# Altium project C210 Rev_B_220601.PrjPcb (part 1 of 5)
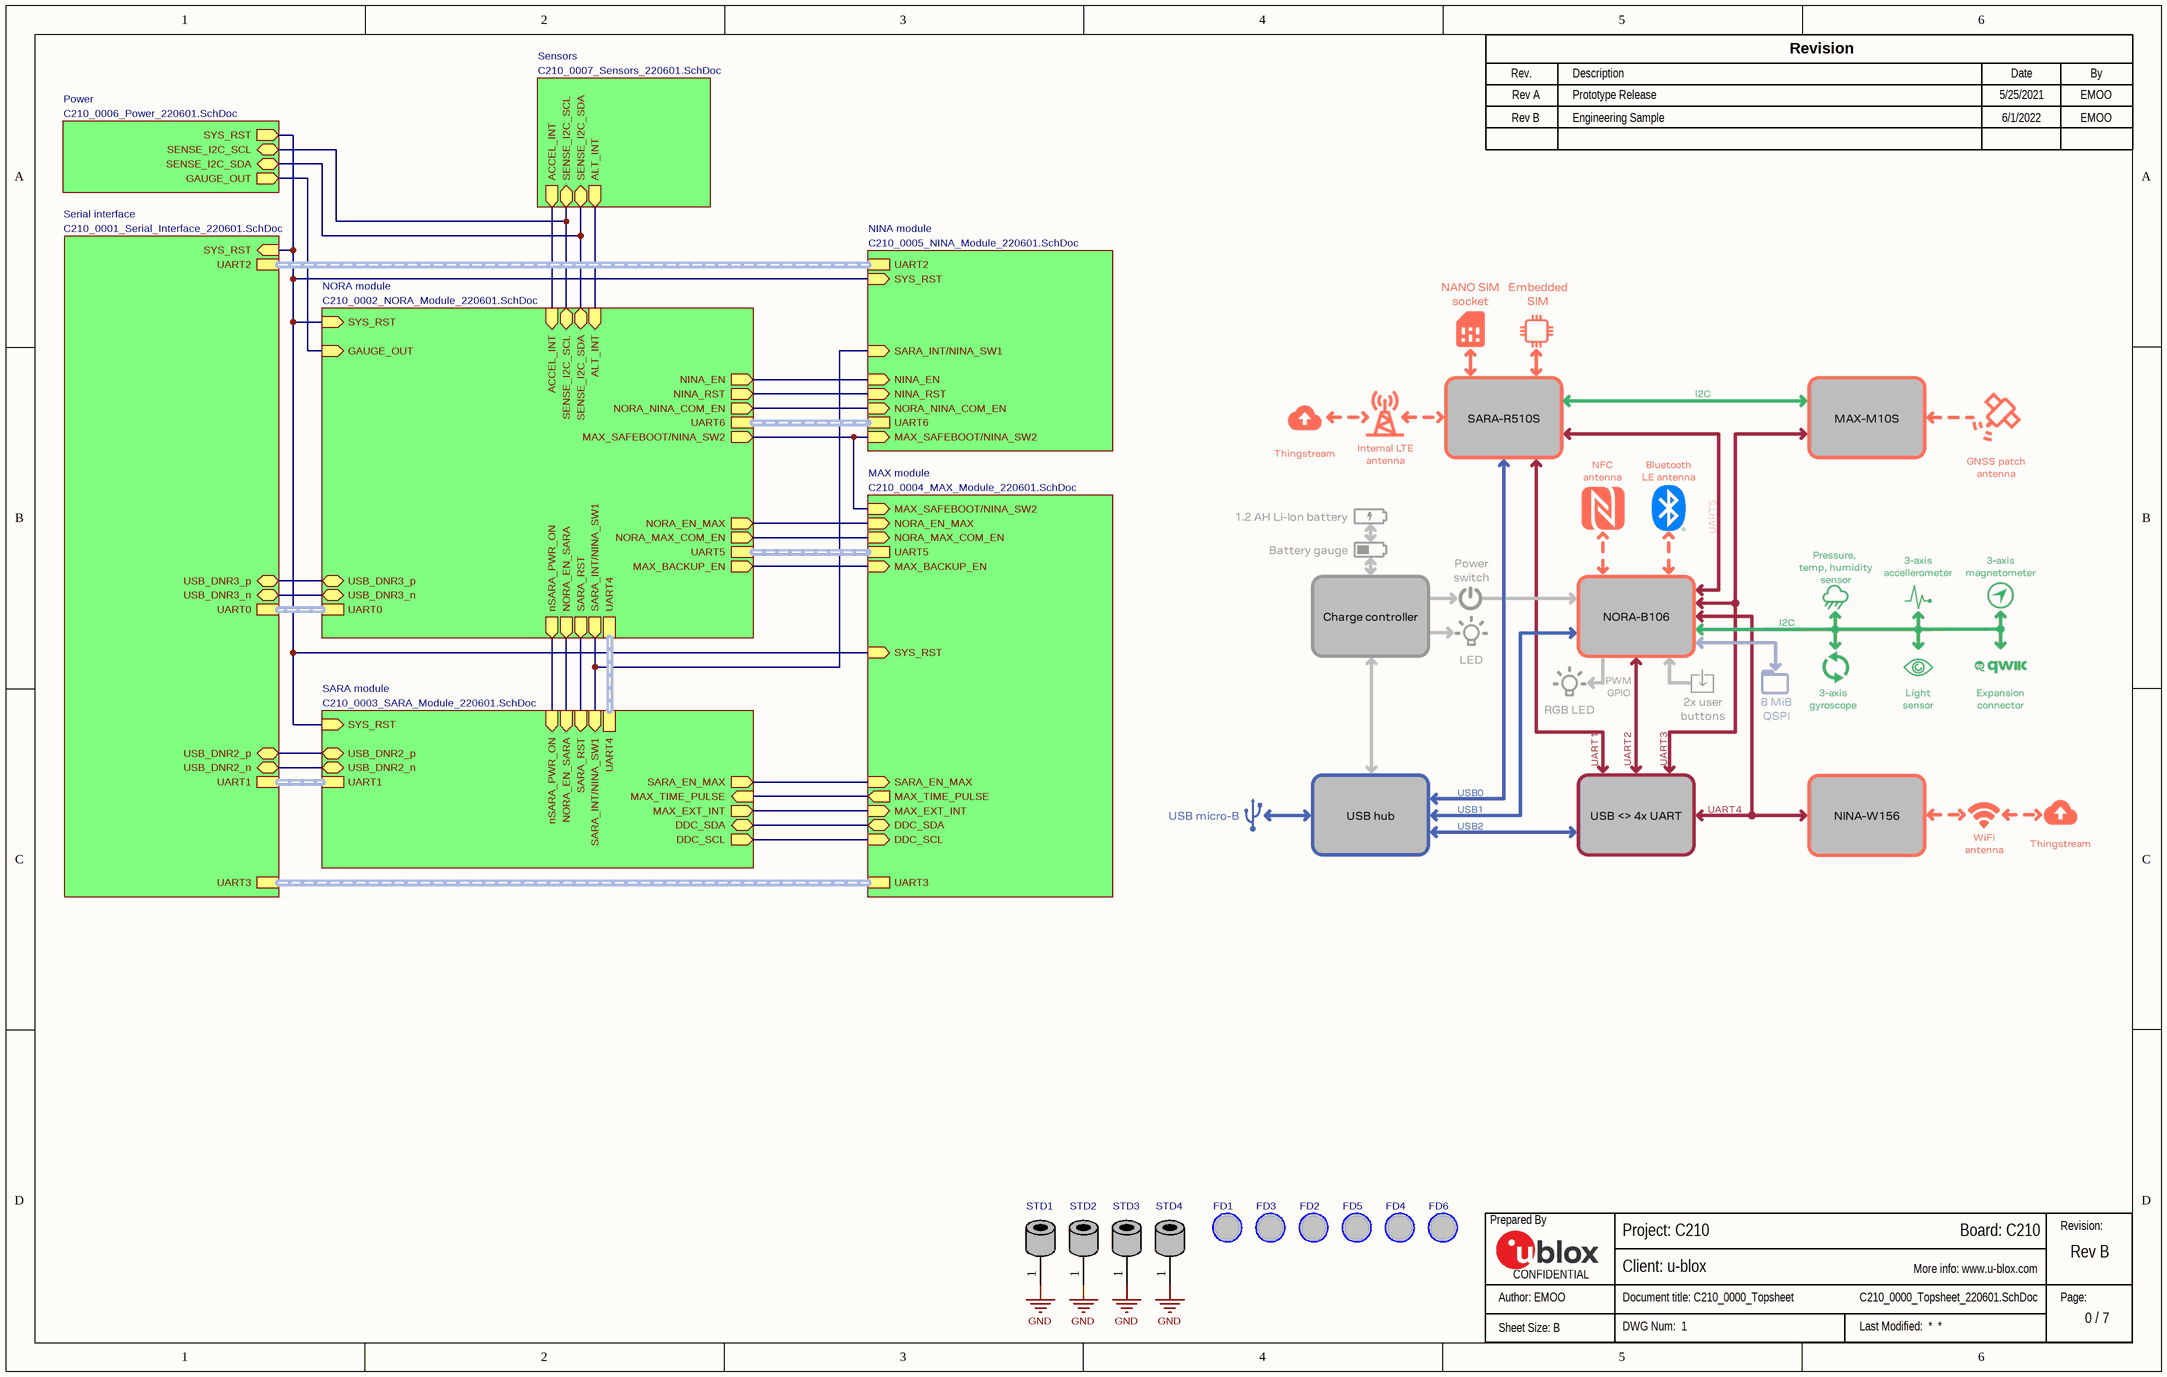
[diagram p0: C210_0000_Topsheet_220601.SchDoc]
SchSheetTotal: 7; SchDocNum: 1; ReleaseRev2: Rev B; ReleaseRev1: Rev A; ReleaseDesc2: Engineering Sample; ReleaseDesc1: Prototype Release; ReleaseDate2: 6/1/2022; ReleaseDate1: 5/25/2021; ReleaseBy2: EMOO; ReleaseBy1: EMOO; ProjectEngineer: EMOO; PCBName: C210; PCBDocNum: C210; GlobalReleaseDate: 6/1/2022; GlobalProjectTeam: u-blox AG; GlobalProjectRevision: Rev B; GlobalProjectName: C210; GlobalProjectLink: www.u-blox.com; GlobalClientName: u-blox
8 sheets, 502 parts. Net scope: flat (ports and power ports of the same name join across sheets).
Board file: C210_220601.PcbDoc
Sheets:
  C210_0000_Topsheet_220601.SchDoc
    NORA module = C210_0002_NORA_Module_220601.SchDoc
    SARA module = C210_0003_SARA_Module_220601.SchDoc
    Power = C210_0006_Power_220601.SchDoc
    Sensors = C210_0007_Sensors_220601.SchDoc
    Serial interface = C210_0001_Serial_Interface_220601.SchDoc
    MAX module = C210_0004_MAX_Module_220601.SchDoc
    NINA module = C210_0005_NINA_Module_220601.SchDoc

## Sheet C210_0000_Topsheet_220601.SchDoc: C210_0000_Topsheet
size B; Date: 2/26/2021; CompanyName: U-blox; DrawnBy: EMOO; Engineer: EMOO; Organization: U-blox; Address1: 2601 25th St. SE; Address2: Salem, OR 97302; SheetNumber: 0; SheetTotal: 7; Website: www.u-blox.com; SheetSize: B; SheetTitle: C-210 Topsheet

### Parts
(Parts that share a designator on the sheet are numbered #1, #2 ... from top to bottom, then left to right.)
?#1  (no value)  (graphical)
?#2  (no value)  (graphical)
FD1  Fiducial_1mmDNP  [Fiducial 1mm - Circle]  (value not drawn)  (no BOM)
FD2  Fiducial_1mmDNP  [Fiducial 1mm - Circle]  (value not drawn)  (no BOM)
FD3  Fiducial_1mmDNP  [Fiducial 1mm - Circle]  (value not drawn)  (no BOM)
FD4  Fiducial_1mmDNP  [Fiducial 1mm - Circle]  (value not drawn)  (no BOM)
FD5  Fiducial_1mmDNP  [Fiducial 1mm - Circle]  (value not drawn)  (no BOM)
FD6  Fiducial_1mmDNP  [Fiducial 1mm - Circle]  (value not drawn)  (no BOM)
STD1  (no value)  [9774020951R]
STD2  (no value)  [9774020951R]
STD3  (no value)  [9774020951R]
STD4  (no value)  [9774020951R]

### Sub-sheets
MAX module = C210_0004_MAX_Module_220601.SchDoc: DDC_SCL (in), DDC_SDA (bidir), UART3 (harness UART3), UART5 (harness UART5), MAX_BACKUP_EN (in), MAX_TIME_PULSE (out), NORA_EN_MAX (in), SARA_EN_MAX (in), NORA_MAX_COM_EN (in), MAX_EXT_INT (in), SYS_RST (in), MAX_SAFEBOOT/NINA_SW2 (in)
NINA module = C210_0005_NINA_Module_220601.SchDoc: UART6 (harness UART6), NORA_NINA_COM_EN (in), NINA_RST (in), UART2 (harness UART2), SYS_RST (in), NINA_EN (in), SARA_INT/NINA_SW1 (in), MAX_SAFEBOOT/NINA_SW2 (in)
NORA module = C210_0002_NORA_Module_220601.SchDoc: UART0 (harness UART0), UART4 (harness UART4), SARA_RST (out), UART5 (harness UART5), ACCEL_INT (in), SENSE_I2C_SDA (bidir), SENSE_I2C_SCL (bidir), NORA_MAX_COM_EN (out), NORA_EN_MAX (out), UART6 (harness UART6), NINA_EN (out), NORA_NINA_COM_EN (out), nSARA_PWR_ON (out), MAX_BACKUP_EN (out), NINA_RST (out), USB_DNR3_p (bidir), USB_DNR3_n (bidir), SYS_RST (in), NORA_EN_SARA (out), GAUGE_OUT (in), ALT_INT (in), SARA_INT/NINA_SW1 (out), MAX_SAFEBOOT/NINA_SW2 (out)
Power = C210_0006_Power_220601.SchDoc: SYS_RST (out), GAUGE_OUT (out), SENSE_I2C_SCL (bidir), SENSE_I2C_SDA (bidir)
SARA module = C210_0003_SARA_Module_220601.SchDoc: UART4 (harness UART4), DDC_SDA (bidir), DDC_SCL (out), SARA_RST (in), MAX_TIME_PULSE (in), MAX_EXT_INT (out), SARA_EN_MAX (out), nSARA_PWR_ON (in), USB_DNR2_n (bidir), USB_DNR2_p (bidir), UART1 (harness UART1), SYS_RST (in), NORA_EN_SARA (in), SARA_INT/NINA_SW1 (in)
Sensors = C210_0007_Sensors_220601.SchDoc: SENSE_I2C_SCL (bidir), ACCEL_INT (out), SENSE_I2C_SDA (bidir), ALT_INT (out)
Serial interface = C210_0001_Serial_Interface_220601.SchDoc: UART1 (harness UART1), UART3 (harness UART3), UART2 (harness UART2), UART0 (harness UART0), USB_DNR2_p (bidir), USB_DNR2_n (bidir), USB_DNR3_p (bidir), USB_DNR3_n (bidir), SYS_RST (in)

### Nets
GND: STD1.1 STD2.1 STD3.1 STD4.1
(unnamed): sheet NORA module/SARA_RST, sheet SARA module/SARA_RST
(unnamed): sheet NORA module/ACCEL_INT, sheet Sensors/ACCEL_INT
(unnamed): sheet NORA module/SENSE_I2C_SDA, sheet Power/SENSE_I2C_SDA, sheet Sensors/SENSE_I2C_SDA
(unnamed): sheet NORA module/SENSE_I2C_SCL, sheet Power/SENSE_I2C_SCL, sheet Sensors/SENSE_I2C_SCL
(unnamed): sheet NORA module/NORA_MAX_COM_EN, sheet MAX module/NORA_MAX_COM_EN
(unnamed): sheet NORA module/NORA_EN_MAX, sheet MAX module/NORA_EN_MAX
(unnamed): sheet NORA module/NINA_EN, sheet NINA module/NINA_EN
(unnamed): sheet NORA module/NORA_NINA_COM_EN, sheet NINA module/NORA_NINA_COM_EN
(unnamed): sheet NORA module/nSARA_PWR_ON, sheet SARA module/nSARA_PWR_ON
(unnamed): sheet NORA module/MAX_BACKUP_EN, sheet MAX module/MAX_BACKUP_EN
(unnamed): sheet NORA module/NINA_RST, sheet NINA module/NINA_RST
(unnamed): sheet NORA module/USB_DNR3_p, sheet Serial interface/USB_DNR3_p
(unnamed): sheet NORA module/USB_DNR3_n, sheet Serial interface/USB_DNR3_n
(unnamed): sheet NORA module/SYS_RST, sheet SARA module/SYS_RST, sheet Power/SYS_RST, sheet Serial interface/SYS_RST, sheet MAX module/SYS_RST, sheet NINA module/SYS_RST
(unnamed): sheet NORA module/NORA_EN_SARA, sheet SARA module/NORA_EN_SARA
(unnamed): sheet NORA module/GAUGE_OUT, sheet Power/GAUGE_OUT
(unnamed): sheet NORA module/ALT_INT, sheet Sensors/ALT_INT
(unnamed): sheet NORA module/SARA_INT/NINA_SW1, sheet SARA module/SARA_INT/NINA_SW1, sheet NINA module/SARA_INT/NINA_SW1
(unnamed): sheet NORA module/MAX_SAFEBOOT/NINA_SW2, sheet MAX module/MAX_SAFEBOOT/NINA_SW2, sheet NINA module/MAX_SAFEBOOT/NINA_SW2
(unnamed): sheet SARA module/DDC_SDA, sheet MAX module/DDC_SDA
(unnamed): sheet SARA module/DDC_SCL, sheet MAX module/DDC_SCL
(unnamed): sheet SARA module/MAX_TIME_PULSE, sheet MAX module/MAX_TIME_PULSE
(unnamed): sheet SARA module/MAX_EXT_INT, sheet MAX module/MAX_EXT_INT
(unnamed): sheet SARA module/SARA_EN_MAX, sheet MAX module/SARA_EN_MAX
(unnamed): sheet SARA module/USB_DNR2_n, sheet Serial interface/USB_DNR2_n
(unnamed): sheet SARA module/USB_DNR2_p, sheet Serial interface/USB_DNR2_p

### Buses and harness runs
harness sheet MAX module/UART3 = sheet Serial interface/UART3
harness sheet MAX module/UART5 = sheet NORA module/UART5
harness sheet NINA module/UART2 = sheet Serial interface/UART2
harness sheet NINA module/UART6 = sheet NORA module/UART6
harness sheet NORA module/UART0 = sheet Serial interface/UART0
harness sheet NORA module/UART4 = sheet SARA module/UART4
harness sheet SARA module/UART1 = sheet Serial interface/UART1

### Notes on the sheet
- Rev.
- Description
- Revision
- Date
- By
- Prepared By
- Revision:
- CONFIDENTIAL
- Page:

### Library data of the parts
?#1 = Top_Revision_Block: Release Revision History Block
?#2 = Top_Title_Block: Top level schematic title block for top level sheet
FD1-FD6 = Fiducial_1mm_Circle: 1mm Fiducial Target; Added By: EMOO; Part Number: Fiducial_1mm; Height: 0; DNP: DNP; Added Date: 12/12/2020
STD1-STD4 = 9774020951R: Standoff, SMT, 2mm, Unthreaded, 2.7mm ID, 5.1mm OD, Steel, Plated; Manufacturer 1: Würth Elektronik; Part Name: SMT STD 2mm; Item Phase: In Production; Use in new designs: Yes; Voltage: None; Part Number: 9774020951R; Manufacturer Part Number 1: 9774020951R; Supplier 1: None; Supplier Part Number 1: None; Diameter: None; Height: 2mm; Max Operating Temp: None; Min Operating Temp: None; Pins: 1; Revision: 0A; UBX Code: None; Manufacturer 2: None; Manufacturer Part Number 2: None; Supplier 2: None; Supplier Part Number 2: None

## Sheet C210_0002_NORA_Module_220601.SchDoc: C210_0002_NORA_Module
size B; Date: 2/26/2021; CompanyName: U-blox; DrawnBy: EMOO; Engineer: EMOO; Organization: U-blox; Address1: 2601 25th St. SE; Address2: Salem, OR 97302; SheetNumber: 2; SheetTotal: 7; Website: www.u-blox.com; SheetSize: B; SheetTitle: C-210 NORA Module
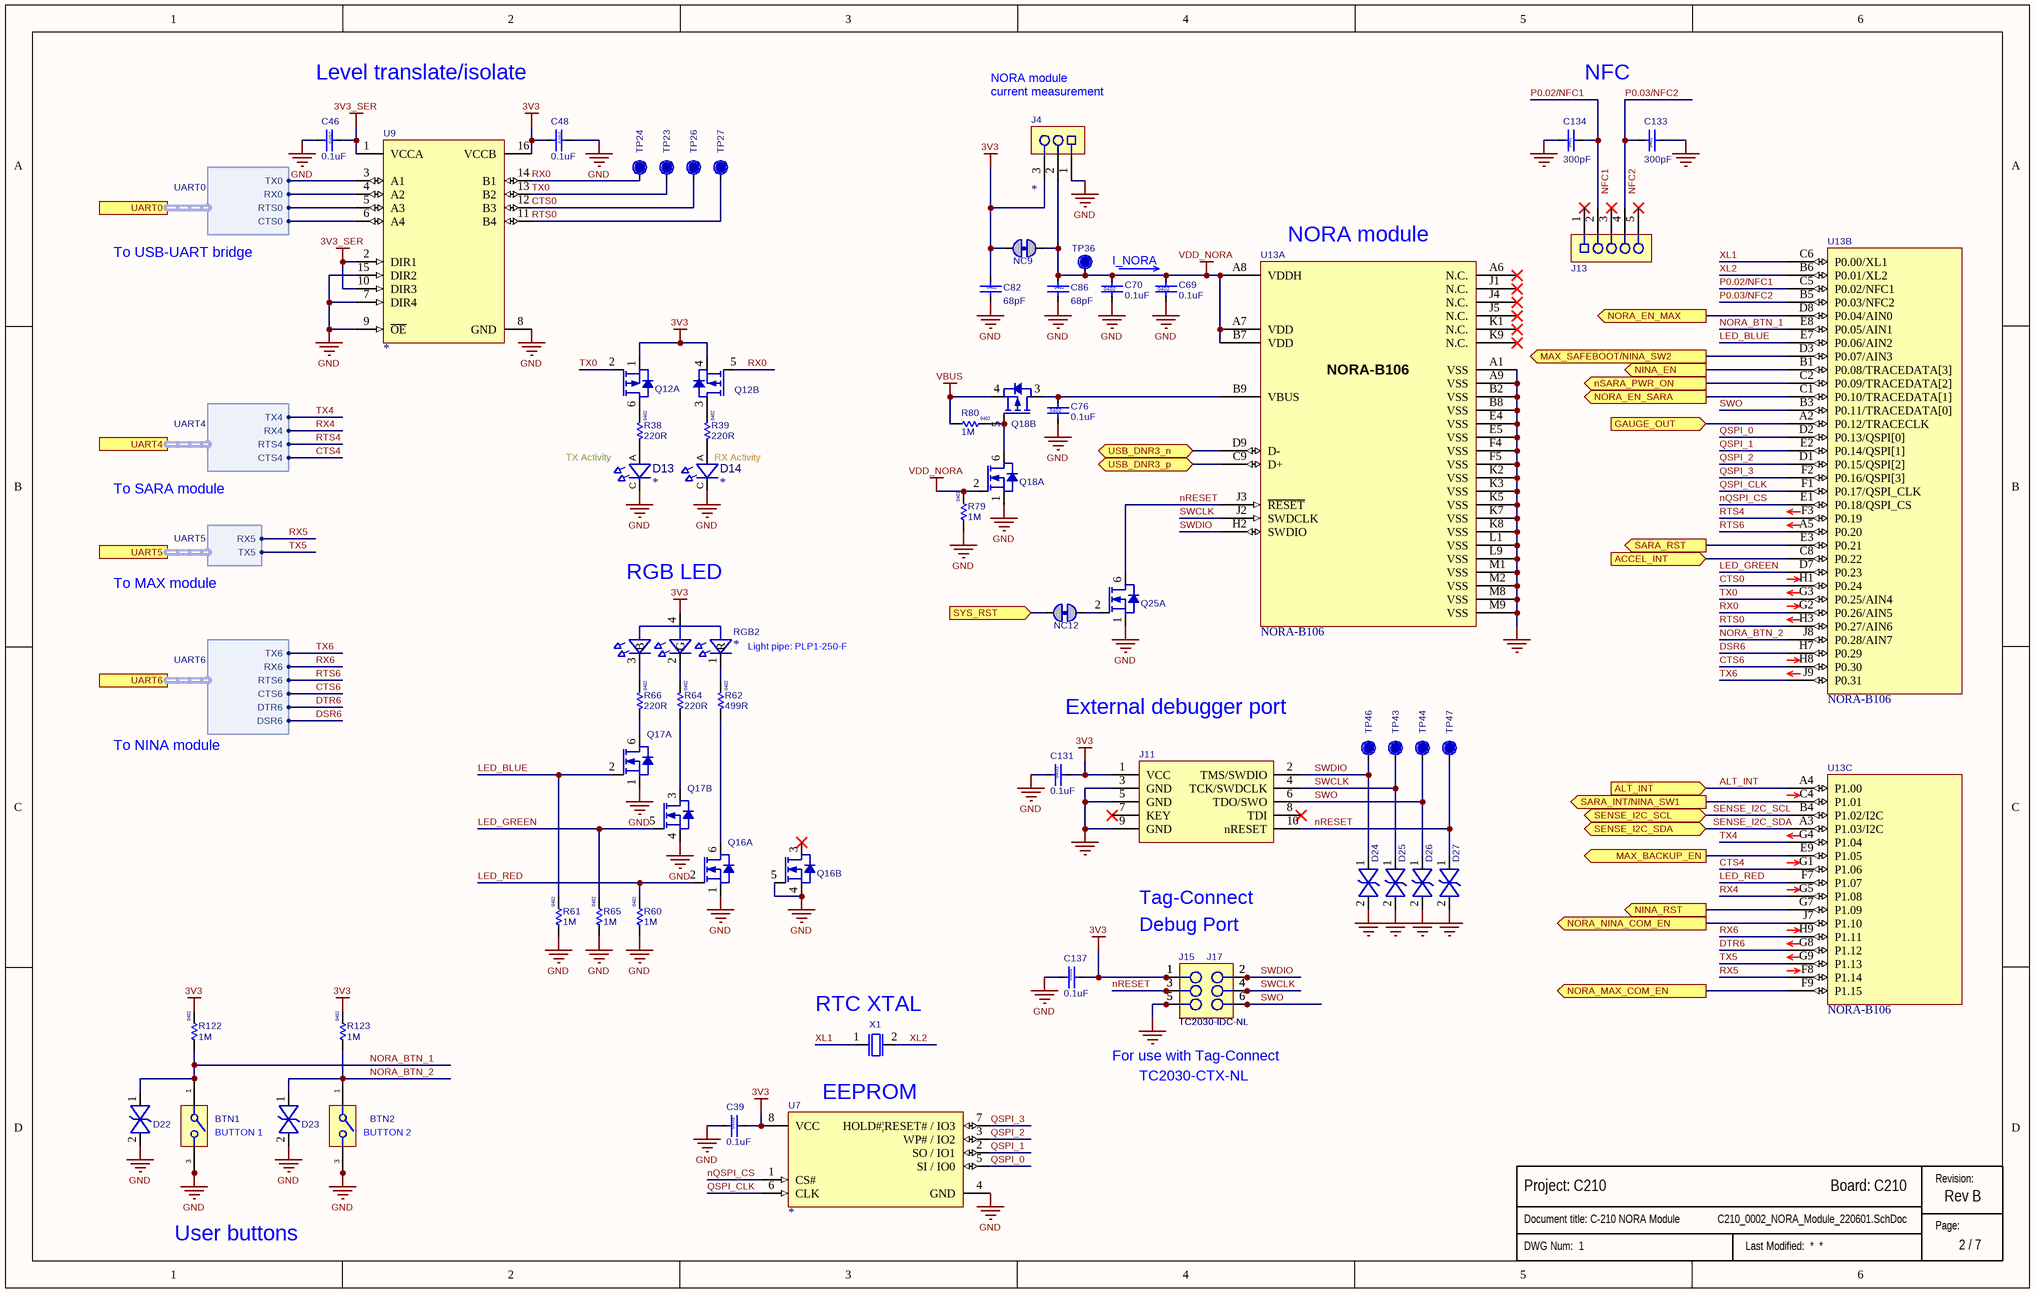
[diagram p1: C210_0002_NORA_Module_220601.SchDoc]

### Parts
(Parts that share a designator on the sheet are numbered #1, #2 ... from top to bottom, then left to right.)
?#3  (no value)  (graphical)
BTN1  (no value)  [TL6120DF300QG]
BTN2  (no value)  [TL6120DF300QG]
C39  value 0.1uF  Size: 0402  [Cap 0402 HD]  (hidden comment: 120-000160.1uF)
C46  value 0.1uF  Size: 0402  [Cap 0402 HD]  (hidden comment: 120-000160.1uF)
C48  value 0.1uF  Size: 0402  [Cap 0402 HD]  (hidden comment: 120-000160.1uF)
C69  value 0.1uF  Size: 0402  [Cap 0402 HD]  (hidden comment: 120-000160.1uF)
C70  value 0.1uF  Size: 0402  [Cap 0402 HD]  (hidden comment: 120-000160.1uF)
C76  value 0.1uF  Size: 0402  [Cap 0402 HD]  (hidden comment: 120-000160.1uF)
C82  value 68pF  Size: 0402  [Cap 0402 HD]
C86  value 68pF  Size: 0402  [Cap 0402 HD]
C131  value 0.1uF  Size: 0402  [Cap 0402 HD]  (hidden comment: 120-000160.1uF)
C133  value 300pF  Size: 0402  [Cap 0402 HD]
C134  value 300pF  Size: 0402  [Cap 0402 HD]
C137  value 0.1uF  Size: 0402  [Cap 0402 HD]  (hidden comment: 120-000160.1uF)
D13  (no value)  [LTST-C190KGKT]
D14  (no value)  [LTST-C190YKT]
D22  (no value)  [SOD-523_ALT]
D23  (no value)  [SOD-523_ALT]
D24  (no value)  [SOD-523_ALT]
D25  (no value)  [SOD-523_ALT]
D26  (no value)  [SOD-523_ALT]
D27  (no value)  [SOD-523_ALT]
J4  (no value)  [HDR-0.1P-3Pin-1Row-SMT]
J11  FTSH-105-01-F-DH-A-C - JTAG  [FTSH-105-01-F-DH-A-C]  (value not drawn)
J13  130-00098  [Molex 051281-0594]  (value not drawn)
J15  TC2030-IDC-NLDNP  [TC2030-IDC-NL]  (value not drawn)  (no BOM)
J17  Manufacturer P/N: TC2030-IDC-NL  [TC2030-IDC-NL No Hole]  (hidden comment: TC2030-IDC-NLDNP)  (no BOM)
NC9  Solderbridge-ShortDNP  [Solderbridge-Short]  (value not drawn)  (net tie, no BOM)
NC12  Solderbridge-ShortDNP  [Solderbridge-Short]  (value not drawn)  (net tie, no BOM)
Q12  (no value)  [FDY2000PZ]  (parts A,B of 2)
Q16  (no value)  [SOT-563]  (parts A,B of 2)
Q17  (no value)  [SOT-563]  (parts A,B of 2)
Q18  (no value)  [SOT-563]  (parts A,B of 2)
Q25  (no value)  [SOT-563]  (part A of 2)
R38  value 220R  Size: 0402  [RES 0402 HD]
R39  value 220R  Size: 0402  [RES 0402 HD]
R60  value 1M  Size: 0402  [RES 0402 HD]
R61  value 1M  Size: 0402  [RES 0402 HD]
R62  value 499R  Size: 0402  [RES 0402 HD]
R64  value 220R  Size: 0402  [RES 0402 HD]
R65  value 1M  Size: 0402  [RES 0402 HD]
R66  value 220R  Size: 0402  [RES 0402 HD]
R79  value 1M  Size: 0402  [RES 0402 HD]
R80  value 1M  Size: 0402  [RES 0402 HD]
R122  value 1M  Size: 0402  [RES 0402 HD]
R123  value 1M  Size: 0402  [RES 0402 HD]
RGB2  (no value)  [LED_1616]
TP23  TP  [TP12R]  (value not drawn)  (no BOM)
TP24  TP  [TP12R]  (value not drawn)  (no BOM)
TP26  TP  [TP12R]  (value not drawn)  (no BOM)
TP27  TP  [TP12R]  (value not drawn)  (no BOM)
TP36  TP  [TP12R]  (value not drawn)  (no BOM)
TP43  TP  [TP12R]  (value not drawn)  (no BOM)
TP44  TP  [TP12R]  (value not drawn)  (no BOM)
TP46  TP  [TP12R]  (value not drawn)  (no BOM)
TP47  TP  [TP12R]  (value not drawn)  (no BOM)
U7  (no value)  [WSON1.27P-8Pin_W-Pad]
U9  (no value)  [QFN0.5P2x6-16Pin_W-Pad]
U13  NORA-B106  [NORA_LGA82R_1430X1040X180_ANT]  (parts A,B,C of 3)
X1  (no value)  [XTAL_3215]

### Ports
ACCEL_INT (in), ALT_INT (in), GAUGE_OUT (in), MAX_BACKUP_EN (out), MAX_SAFEBOOT/NINA_SW2 (out), NINA_EN (out), NINA_RST (out), NORA_EN_MAX (out), NORA_EN_SARA (out), NORA_MAX_COM_EN (out), NORA_NINA_COM_EN (out), nSARA_PWR_ON (out), SARA_INT/NINA_SW1 (out), SARA_RST (out), SENSE_I2C_SCL (bidir), SENSE_I2C_SDA (bidir), SYS_RST (in), UART0 (harness UART0), UART4 (harness UART4), UART5 (harness UART5), UART6 (harness UART6), USB_DNR3_n (bidir), USB_DNR3_p (bidir)

### Harnesses
UART0: TX0, RX0, RTS0, CTS0
UART4: TX4, RX4, RTS4, CTS4
UART5: TX5, RX5
UART6: TX6, RX6, RTS6, CTS6, DTR6, DSR6

### Nets
3V3: C39.2 C48.2 C82.1 C131.2 C137.2 J4.3 J11.1(VCC) J15.1 J17.1 NC9.2 Q12.1(S1) Q12.4(S2) R122.2 R123.2 RGB2.4(A) U7.8(VCC) U9.16(VCCB)
3V3_SER: C46.1 U9.1(VCCA) U9.2(DIR1) U9.10(DIR3)
GND: BTN1.3 BTN1.4 BTN2.3 BTN2.4 C39.1 C46.2 C48.1 C69.1 C70.1 C76.1 C82.2 C86.2 C131.1 C133.2 C134.1 C137.1 D13.C(Cathode) D14.C(Cathode) D22.2 D23.2 D24.2 D25.2 D26.2 D27.2 J4.1 J11.3(GND) J11.5(GND) J11.9(GND) J15.5 J17.5 Q16.1(S1) Q16.4(S2) Q16.5(G2) Q17.1(S1) Q17.4(S2) Q18.1(S1) Q25.1(S1) R60.1 R61.1 R65.1 R79.1 U7.4(GND) U9.7(DIR4) U9.8(GND) U9.9(~{OE}) U9.15(DIR2) U13.A1(VSS) U13.A9(VSS) U13.B2(VSS) U13.B8(VSS) U13.E4(VSS) U13.E5(VSS) U13.F4(VSS) U13.F5(VSS) U13.K2(VSS) U13.K3(VSS) U13.K5(VSS) U13.K7(VSS) U13.K8(VSS) U13.L1(VSS) U13.L9(VSS) U13.M1(VSS) U13.M2(VSS) U13.M8(VSS) U13.M9(VSS)
VBUS: Q18.4(S2) R80.1
VDD_NORA: C69.2 C70.2 C86.1 J4.2 NC9.1 Q18.2(G1) R79.2 TP36.1 U13.A7(VDD) U13.A8(VDDH) U13.B7(VDD)
ACCEL_INT: U13.C8(P0.22) ; port ACCEL_INT
ALT_INT: U13.A4(P1.00) ; port ALT_INT
CTS0: TP26.1 U9.12(B3) U13.H1(P0.24)
CTS4: U13.G1(P1.06) ; port UART4.CTS4
CTS6: U13.H8(P0.30) ; port UART6.CTS6
DSR6: U13.H7(P0.29) ; port UART6.DSR6
DTR6: U13.G8(P1.12) ; port UART6.DTR6
LED_BLUE: Q17.2(G1) R61.2 U13.E7(P0.06/AIN2)
LED_GREEN: Q17.5(G2) R65.2 U13.D7(P0.23)
LED_RED: Q16.2(G1) R60.2 U13.F7(P1.07)
NFC1: C134.2 J13.2 U13.C5(P0.02/NFC1)  [also labelled P0.02/NFC1]
NFC2: C133.1 J13.4 U13.B5(P0.03/NFC2)  [also labelled P0.03/NFC2]
NORA_BTN_1: BTN1.1 BTN1.2 D22.1 R122.1 U13.E8(P0.05/AIN1)
NORA_BTN_2: BTN2.1 BTN2.2 D23.1 R123.1 U13.J8(P0.28/AIN7)
nQSPI_CS: U7.1(CS#) U13.E1(P0.18/QSPI_CS)
nRESET: D27.1 J11.10(nRESET) J15.3 J17.3 Q25.6(D1) TP47.1 U13.J3(~{RESET})
QSPI_0: U7.5(SI_/_IO0) U13.D2(P0.13/QSPI[0])
QSPI_1: U7.2(SO_/_IO1) U13.E2(P0.14/QSPI[1])
QSPI_2: U7.3(WP#_/_IO2) U13.D1(P0.15/QSPI[2])
QSPI_3: U7.7(HOLD#|RESET#_/_IO3) U13.F2(P0.16/QSPI[3])
QSPI_CLK: U7.6(CLK) U13.F1(P0.17/QSPI_CLK)
RTS0: TP27.1 U9.11(B4) U13.H3(P0.27/AIN6)
RTS4: U13.F3(P0.19) ; port UART4.RTS4
RTS6: U13.A5(P0.20) ; port UART6.RTS6
RX0: Q12.5(G2) TP24.1 U9.14(B1) U13.G2(P0.26/AIN5)
RX4: U13.G5(P1.08) ; port UART4.RX4
RX5: U13.F8(P1.14) ; port UART5.RX5
RX6: U13.H9(P1.11) ; port UART6.RX6
SENSE_I2C_SCL: U13.B4(P1.02/I2C) ; port SENSE_I2C_SCL
SENSE_I2C_SDA: U13.A3(P1.03/I2C) ; port SENSE_I2C_SDA
SWCLK: D25.1 J11.4(TCK/SWDCLK) J15.4 J17.4 TP43.1 U13.J2(SWDCLK)
SWDIO: D24.1 J11.2(TMS/SWDIO) J15.2 J17.2 TP46.1 U13.H2(SWDIO)
SWO: D26.1 J11.6(TDO/SWO) J15.6 J17.6 TP44.1 U13.B3(P0.11/TRACEDATA[0])
SYS_RST: NC12.2 ; port SYS_RST
TX0: Q12.2(G1) TP23.1 U9.13(B2) U13.G3(P0.25/AIN4)
TX4: U13.G4(P1.04) ; port UART4.TX4
TX5: U13.G9(P1.13) ; port UART5.TX5
TX6: U13.J9(P0.31) ; port UART6.TX6
USB_DNR3_n: U13.D9(D-) ; port USB_DNR3_n
USB_DNR3_p: U13.C9(D+) ; port USB_DNR3_p
XL1: U13.C6(P0.00/XL1) X1.1
XL2: U13.B6(P0.01/XL2) X1.2
NetC76_2: C76.2 Q18.3(D2) U13.B9(VBUS)
NetD13_A: D13.A(Anode) R38.1
NetD14_A: D14.A(Anode) R39.1
NetNC12_1: NC12.1 Q25.2(G1)
NetQ1_2: U13.C4(P1.01) ; port SARA_INT/NINA_SW1
NetQ1_5: U13.D3(P0.07/AIN3) ; port MAX_SAFEBOOT/NINA_SW2
NetQ2_2: U13.G7(P1.09) ; port NINA_RST
NetQ4_5: U13.E3(P0.21) ; port SARA_RST
NetQ10_2: U13.C1(P0.10/TRACEDATA[1]) ; port NORA_EN_SARA
NetQ10_5: U13.C2(P0.09/TRACEDATA[2]) ; port nSARA_PWR_ON
NetQ12_3: Q12.3(D2) R39.2
NetQ12_6: Q12.6(D1) R38.2
NetQ13_2: U13.J7(P1.10) ; port NORA_NINA_COM_EN
NetQ16_6: Q16.6(D1) R62.1
NetQ17_3: Q17.3(D2) R64.1
NetQ17_6: Q17.6(D1) R66.1
NetQ18_5: Q18.5(G2) Q18.6(D1) R80.2
NetQ26_2: U13.D8(P0.04/AIN0) ; port NORA_EN_MAX
NetR37_1: U13.B1(P0.08/TRACEDATA[3]) ; port NINA_EN
NetR50_2: U13.A2(P0.12/TRACECLK) ; port GAUGE_OUT
NetR62_2: R62.2 RGB2.1(R)
NetR64_2: R64.2 RGB2.2(G)
NetR66_2: R66.2 RGB2.3(B)
NetR67_1: U13.E9(P1.05) ; port MAX_BACKUP_EN
NetR83_2: U13.F9(P1.15) ; port NORA_MAX_COM_EN
NetU6_54: U9.6(A4) ; port UART0.CTS0
NetU6_55: U9.5(A3) ; port UART0.RTS0
NetU6_56: U9.4(A2) ; port UART0.RX0
NetU6_57: U9.3(A1) ; port UART0.TX0

Not connected (* = marked no-connect by the designer): J11 7(KEY)* 8(TDI)*; J13 1* 3* 5*; Q16 3(D2)*; U13 A6(N.C.)* J1(N.C.)* J4(N.C.)* J5(N.C.)* K1(N.C.)* K9(N.C.)*

### Notes on the sheet
- Level translate/isolate
- NORA module
- current measurement
- NFC
- To USB-UART bridge
- I_NORA
- (near U13) NORA module
- To SARA module
- TX Activity
- (near D14) RX Activity
- To MAX module
- (near RGB2) RGB LED
- (near RGB2) Light pipe: PLP1-250-F
- To NINA module
- External debugger port
- Tag-Connect
- Debug Port
- (near X1) RTC XTAL
- (near U7) EEPROM
- For use with Tag-Connect
- TC2030-CTX-NL
- (near BTN1) BUTTON 1
- (near BTN2) BUTTON 2
- User buttons
- Revision:
- Page:

### Library data of the parts
?#3 = Sub_Title_Block: Minimized schematic title block for all subset sheets
BTN1 BTN2 = TL6120DF300QG: Button, Tactile, SPST, NO, SMT, Vert; Manufacturer 1: E-Switch; Part Name: CON HDR 0.1" 3 Pin 1 Row SMT R/A; Item Phase: In Production; Use in new designs: Yes; Voltage: None; Part Number: TL6120DF300QG; Manufacturer Part Number 1: TL6120DF300QG; Supplier 1: None; Supplier Part Number 1: None; Diameter: None; Height: 3.05mm; Max Operating Temp: None; Min Operating Temp: None; Pins: 3; Revision: 0A; UBX Code: None; Manufacturer 2: None; Manufacturer Part Number 2: None; Supplier 2: None; Supplier Part Number 2: None; Manufacturer P/N: *
C39 C46 C48 C69 C70 C76 C131 C137 = 120-00016: Cap, Ceramic 0.1uF 10V 10% X5R 0402; Part Name: CAP CER 0.1UF 10V 10% X5R 0402; Part_Type: Ceramic Capacitor; Manufacturer: Murata Electronics North America; Manufacturer P/N: GRM155R61A104KA01J; Item_Phase: Production; Component Mounting Type: SMT; Tolerance: +/- 10%; Use in new designs: Yes; Part Number: 120-00016; Revision: 0A; Supplier 1: Digi-Key; Supplier Part Number 1: 490-6297-1-ND; Manufacturer 2: Yageo; Manufacturer P/N 2: CC0402KRX5R6BB104; Supplier 2: Digi-Key; Supplier Part Number 2: 311-1336-1-ND; Arena Link: https://app.bom.com/a/GYHPV2L2L43KRMBK?v=spec.summary; Height: 0.55mm; Pins: 2; Temperature Coefficient: X5R; Voltage: 10V
C82 C86 = 120-00047: Cap, Ceramic, 68pF, 50V, 1%, NP0, 0402; Manufacturer 1: Murata Electronics North America; Manufacturer Part Number 1: GRM1555C1H680FA01D; Part Name: CAP CER 68PF 50V 1% NP0 0402; Item Phase: Unreleased; Tolerance: +/- 1%; Use in new designs: Yes; UBX Code: None; Part Number: 120-00047; Supplier 1: Digi-Key; Supplier Part Number 1: 490-8219-1-ND; Manufacturer 2: AVX Corporation; Manufacturer Part Number 2: 04025A680FAT2A; Supplier 2: Digi-Key; Supplier Part Number 2: 478-7881-1-ND; Height: 0.55mm; Max Operating Temp: 125; Min Operating Temp: -55; Pins: 2; Revision: None; Temperature Coefficient: NP0; Voltage: 50V
C133 C134 = 120-00099: Cap, Ceramic 300pF 50V 5% NP0 0402; Part Name: CAP CER 300pF 50V 5% NP0 0402; Part_Type: Ceramic Capacitor; Manufacturer: Murata Electronics North America; Manufacturer P/N: GRM1555C1H301JA01D; Item_Phase: Production; Component Mounting Type: SMT; Tolerance: +/- 5%; Use in new designs: Yes; Part Number: 120-00099; Supplier 1: Digi-Key; Supplier Part Number 1: 490-3234-1-ND; Arena Link: https://app.bom.com/a/BTCKQXGXGZYCR3MS?v=spec.summary; Height: 0.55mm; Pins: 2; Temperature Coefficient: NP0; Voltage: 50V; Revision: 0B; Manufacturer 2: CCK; Manufacturer P/N 2: CCK0402NPO5J301PL; Alternate Footprint Ref: Cap 0402
D13 = LTST-C190KGKT: DIODE, LED, SMT, GREEN, CLEAR LENS, 2.0V 20mA, 0603; Part Number: 115-00019; Manufacturer 1: Lite-On Inc; Part Name: LED Green SMT 0603; Body Size: 1.60mm x 0.80mm; Item Phase: In Production; MFG Package: None; Use in new designs: Yes; Manufacturer Part Number 1: LTST-C190KGKT; Supplier 1: Digi-Key; Supplier Part Number 1: 160-1435-2-ND; Current: 20mA; Height: 0.80mm; Max Operating Temp: 85; Min Operating Temp: -30; Pins: 2; Revision: 0A; Size: 0603; Voltage: 2.0V; UBX Code: None; Manufacturer 2: None; Manufacturer Part Number 2: None; Supplier 2: None; Supplier Part Number 2: None; Color: *
D14 = LTST-C190YKT: DIODE, LED, SMT, YELLOW, CLEAR LENS, 2.1V 10mA, 0603; Manufacturer 1: Lite-On Inc; Part Name: LED Yellow SMT 0603; Body Size: 1.60mm x 0.80mm; Item Phase: In Production; MFG Package: None; Use in new designs: Yes; Part Number: LTST-C190YKT; Manufacturer Part Number 1: LTST-C190YKT; Supplier 1: Digi-Key; Supplier Part Number 1: 160-1184-2-ND; Current: 10mA; Height: 0.80mm; Max Operating Temp: 85; Min Operating Temp: -30; Pins: 2; Revision: 0A; Size: 0603; Voltage: 2.1V; UBX Code: None; Manufacturer 2: None; Manufacturer Part Number 2: None; Supplier 2: None; Supplier Part Number 2: None; Color: *
D22-D27 = 110-00041: Diode TVS 5VWM BiDIR SOD523; Manufacturer 1: ON Semiconductor; Manufacturer Part Number 1: ESD5B5.0ST1G; Part Name: Diode TVS 5VWM SOD523; Body Size: 1.2mm x 0.8mm; Current: None; Item Phase: Unreleased; MFG Package: SOD-523; Use in new designs: Yes; Part Number: 110-00041; Supplier 1: Digi-Key; Supplier Part Number 1: ESD5B5.0ST1GOSCT-ND; Manufacturer 2: None; Manufacturer Part Number 2: None; Supplier 2: None; Supplier Part Number 2: None; Height: 0.7mm; Max Operating Temp: 150; Min Operating Temp: -55; Pins: 2; Revision: None; Voltage: 5VWM; UBX Code: None
J4 = 130-00105: Header, 0.100" Pitch, 3 Pin, Vertical SMT, Black; Manufacturer 1: Harwin Inc; Manufacturer Part Number 1: M20-8770342; Part Name: CON HDR 0.1" 3 Pin 1 Row SMT; Item Phase: In Production; Use in new designs: Yes; Voltage: None; Manufacturer P/N: *; Part Number: 130-00105; Supplier 1: Digi-Key; Supplier Part Number 1: 952-1951-ND; Diameter: None; Height: 9.93mm; Max Operating Temp: None; Min Operating Temp: None; Pins: 3; Revision: 0C; UBX Code: None; Manufacturer 2: Greenconn Corporation; Manufacturer Part Number 2: GPHC1010302A081B1BD; Supplier 2: Teamwise Limited; Supplier Part Number 2: Greenconn Corporation GPHC1010302A081B1BD
J11 = FTSH-105-01-F-DH-A-C - JTAG: Header 0.05" 10Pin 2Row SMD, RA, Black; Part Name: CON HDR 0.05" 10Pin 2Row RA SMD Black; Part_Type: Connector; Manufacturer: Samtec; Item_Phase: Pre-Production; Component Mounting Type: SMT; Keyed: Yes; Locking: No; Pin Pitch: 0.050"; Rows: 2; Part Number: FTSH-105-01-F-DH-A-C - JTAG; Revision: 1; Manufacturer P/N: FTSH-105-01-F-DH-A-C; Supplier 1: Digi-Key; Supplier Part Number 1: SAM13925TR-ND; Color: Black; Connector Type: Header; Height: 3.96mm; Length: 12.75mm; Pins: 10; Use in new designs: Yes; Width: 6.35
J13 = 130-00098: CON FFC/FPC 0.50mm 5Pos R/A; Manufacturer P/N: 0512810594; Part_Type: Connector; Manufacturer: Molex Inc; Item_Phase: Preliminary; Component Mounting Type: SMT; Connector Type: FPC; Keyed: No; Pin Pitch: 0.5mm; Rows: 1; Use in new designs: Yes; Voltage: 50V; Part Number: 130-00098; Part Name: CON FFC/FPC 0.50mm 5Pos R/A; Supplier 1: Digi-Key; Supplier Part Number 1: WM9836CT-ND; Arena Link: https://app.bom.com/a/ZH08EL4L4NM1OBQL?v=spec.summary; Color: White; Height: 1.2mm; Length: 4.8mm; Locking: No; Pins: 5; Width: 3.55mm
J15 J17 = CON-6Pin_2Row_ALT: CON PADS FOR CBL PLUG-OF-NAILS 6-PIN NO LEGS; Manufacturer: TAG Connect; Added By: emoo; Part Number: TC2030-IDC-NL; Size: 3.81mm x 7.62mm; Height: 0; DNP: DNP; Added Date: 12/3/2015
  J15: Manufacturer P/N: TC2030-IDC-NL
NC9 NC12 = Solderbridge-Short: Added By: Paul B; Part Number: Solderbridge-Short; Height: 0; DNP: DNP; Added Date: 12/2/2015
Q12 = FDY2000PZ: MOSFET DUAL P-CH 20V SOT-563, -350mA; Manufacturer 1: ON Semiconductor; Body Size: 1.6mmx1.6mm; Item Phase: In Production; Transistor Type: Multiple; Thermal Pad: No; Use in new designs: Yes; UBX Code: None; Part Number: FDY2000PZ; Manufacturer Part Number 1: FDY2000PZ; Supplier 1: Digi-Key; Supplier Part Number 1: 2156-FDY2000PZ-ND; Current: -350mA; Height: 0.6mm; MFG Package: SOT-563; Max Operating Temp: 150; Min Operating Temp: -55; Part Name: MOSFET DUAL P-CH 20V SOT-563; Pins: 6; Revision: 0A; Voltage: 20V; Manufacturer 2: None; Manufacturer Part Number 2: None; Supplier 2: None; Supplier Part Number 2: None
Q16 Q17 Q25 = 140-00016: MOSFET 2N-CH 20V 0.8A, SOT-563; Manufacturer 1: Toshiba Semiconductor and Storage; Manufacturer Part Number 1: SSM6N56FE,LM; Part Name: MOSFET 2N-CH 20V 0.8A SOT-563; Body Size: 1.6mm x 1.2mm; Current: 800mA; Item Phase: In Production; Transistor Type: N-Channel; Thermal Pad: No; Use in new designs: Yes; UBX Code: None; Part Number: 140-00016; Supplier 1: Digi-Key; Supplier Part Number 1: SSM6N56FELMCT-ND; Height: 0.6mm; MFG Package: SOT-563; Max Operating Temp: 150; Min Operating Temp: -55; Pins: 6; Revision: 0A; Voltage: 20V; Manufacturer 2: None; Manufacturer Part Number 2: None; Supplier 2: None; Supplier Part Number 2: None
Q18 = 140-00030: MOSFET N/P-CH 20V SOT-563, 540 mA, −430 mA; Manufacturer 1: ON Semiconductor; Manufacturer Part Number 1: NTZD3155CT2G; Body Size: 1.6mmx1.6mm; Item Phase: In Production; Transistor Type: Multiple; Thermal Pad: No; Use in new designs: Yes; UBX Code: None; Part Number: 140-00030; Supplier 1: Digi-Key; Supplier Part Number 1: NTZD3155CT2GOSCT-ND; Current: 540 mA, −430 mA; Height: 0.6mm; MFG Package: SOT-563; Max Operating Temp: 150; Min Operating Temp: -55; Part Name: MOSFET N/P-CH 20V SOT-563; Pins: 6; Revision: 0A; Voltage: 20V; Manufacturer 2: None; Manufacturer Part Number 2: None; Supplier 2: None; Supplier Part Number 2: None
R38 R39 R64 R66 = 180-00098: Resistor, 220ohm, 5%, 1/16W, 0402.; Part Name: RES SMD 220 OHM 5% 1/16W 0402; Manufacturer: Panasonic Electronic Components; Manufacturer P/N: ERJ-2GEJ221X; Item_Phase: Production; Component Mounting Type: SMT; Tolerance: +/- 5%; Use in new designs: Yes; Part Number: 180-00098; Part_Type: Resistor; Supplier 1: Digi-Key; Supplier Part Number 1: P220JCT-ND; Arena Link: https://app.bom.com/a/8Q9HNUDUDWVBJC30?v=spec.summary; Pins: 2; Power: 1/16W; Revision: 0C; Manufacturer 2: Samsung Electro-Mechanics America, Inc; Manufacturer P/N 2: RC1005J221CS; Supplier 2: Digi-Key; Supplier Part Number 2: 1276-4360-1-ND; Alternate Footprint Ref: RES 0402; Height: 0.4mm
R60 R61 R65 R79 R80 R122 R123 = 180-00054: Resistor 1M ohm 1%, 1/16W, 0402; Manufacturer 1: Samsung Electro-Mechanics America, Inc; Manufacturer Part Number 1: RC1005F105CS; Part Name: RES SMD 1M OHM 1% 1/16W 0402; Item Phase: In Production; Tolerance: +/- 1%; Use in new designs: Yes; Voltage: None; Part Number: 180-00054; Supplier 1: Digi-Key; Supplier Part Number 1: 1276-3433-1-ND; Manufacturer 2: Hong Kong Resistors Manufactory; Manufacturer Part Number 2: RCT021MFLF; Supplier 2: None; Supplier Part Number 2: None; Height: 0.4mm; Max Operating Temp: 155; Min Operating Temp: -55; Pins: 2; Power: 1/16W; Revision: 0D; UBX Code: None
R62 = 180-00031: Resistor, 499ohm, 1%, 1/16W, 0402; Part Name: RES SMD 499 OHM 1% 1/16W 0402; Manufacturer: Rohm Semiconductor; Manufacturer P/N: MCR01MRTF4990; Item_Phase: Production; Component Mounting Type: SMT; Tolerance: +/- 1%; Use in new designs: Yes; Part Number: 180-00031; Part_Type: Resistor; Supplier 1: Digi-Key; Supplier Part Number 1: RHM499CDCT-ND; Manufacturer 2: Samsung Electro-Mechanics America, Inc; Manufacturer P/N 2: RC1005F4990CS; Arena Link: https://app.bom.com/a/Q8RZ5CVCVEDU1SS5?v=spec.summary; Height: 0.4mm; Pins: 2; Power: 1/16W; Revision: 0D; Supplier 2: Digi-Key; Supplier Part Number 2: 1276-3992-1-ND; Alternate Footprint Ref: RES 0402
RGB2 = 115-00026: LED RGB SMT 0606; Manufacturer 1: Lite-On Inc; Manufacturer Part Number 1: LTST-C19HE1WT; Body Size: 1.6mm x 1.6mm; Current: 20mA; Item Phase: In Production; MFG Package: 0606; Use in new designs: Yes; Voltage: None; Color: *; Part Number: 115-00026; Supplier 1: Digi-Key; Supplier Part Number 1: 160-2162-1-ND; Height: 0.35mm; Max Operating Temp: 80; Min Operating Temp: -20; Part Name: LED RGB SMT 0606; Pins: 4; Revision: 0B; Size: Other; UBX Code: None; Manufacturer 2: QT Brightek (QTB); Manufacturer Part Number 2: QBLP600-RGB; Supplier 2: Digi-Key; Supplier Part Number 2: 1516-1184-1-ND
TP23 TP24 TP26 TP27 TP36 TP43 TP44 TP46 TP47 = TP_R: Testpoint, Round 1.0mm Dia; Part Number: TP10R; Added By: Jeremy D; Size: 1.0mm; Height: 0; DNP: DNP; Added Date: 2/1/2015; Checked By: Paul B; Checked Date: 2/5/2015
U7 = 240-00033: 64Mbit QSPI NOR Flash; Manufacturer 1: Macronix; Manufacturer Part Number 1: MX25R6435FZNIL0; Part Name: IC Flash 64MBIT 80MHz 8WSON; Body Size: 6mm x 5mm; Interface: SPI; Item Phase: In Production; Memory Type: Flash - NOR; Memory Speed: 80MHZ; MFG Package: 8-WDFN Exposed Pad; SMT Pitch: 1.27mm; Thermal Pad: Yes; Voltage: 3.6V; UBX Code: None; Manufacturer P/N: *; Part Number: 240-00033; Supplier 1: Digi-Key; Supplier Part Number 1: 1092-1201-ND; Height: 0.8mm; Memory Size: 64Mbit; Max Operating Temp: 85; Min Operating Temp: -40; Pins: 8; Revision: 0A; Use in new designs: Yes; Manufacturer 2: None; Manufacturer Part Number 2: None; Supplier 2: None; Supplier Part Number 2: None
U9 = 225-00011: Voltage Level Translator Bidirectional 1 Circuit 4 Channel 380Mbps 16-DHVQFN (2.5x3.5); Manufacturer 1: NXP Semiconductors; Manufacturer Part Number 1: 74AVC4TD245BQ,115; Part Name: TXRX XLATING BIDIR 4CH 16-DHVQFN; Body Size: 2.5mm x 3.5mm; Item Phase: In Production; SMT Pitch: 0.5mm; Thermal Pad: Yes; Voltage: 3.6V; UBX Code: None; Manufacturer P/N: *; Part Number: 225-00011; Supplier 1: Digi-Key; Supplier Part Number 1: 568-9220-1-ND; Height: 1mm; Logic Type: Level Translator; MFG Package: 16-DHVQFN; Max Operating Temp: 125; Min Operating Temp: -40; Pins: 16; Revision: 0B; Use in new designs: Yes; Manufacturer 2: ON Semiconductor; Manufacturer Part Number 2: FXL4TD245BQX; Supplier 2: Digi-Key; Supplier Part Number 2: FXL4TD245BQXCT-ND
U13 = NORA-B106: u-blox NORA-B106 Bluetooth 5.2 LE module - dual core; Manufacturer P/N: NORA-B106-00B; Part Description: Stand-alone Bluetooth low energy module - dual core; Body Size: 14.3 mm x 10.4 mm; Part Number: NORA-B106; Part Name: NORA-B106; Part_Type: Module; Manufacturer: u-blox; Height: 1.8 mm; Value: NORA-B106
X1 = 100-00005: XTAL, 2Pin, 32.768kHz, 7pF 20ppm; Manufacturer P/N: FC-135 32.7680KA-AG3; Part Name: XTAL 32.768kHz 7pF 20ppm 3215; Part_Type: Crystal/Oscillator; Manufacturer: Epson; Item_Phase: Production; Body Size: 3.2mm x 1.5mm; Component Mounting Type: SMT; MFG Package: 2-SMD; Use in new designs: Yes; Part Number: 100-00005; Revision: 0C; Supplier 1: Digi-Key; Supplier Part Number 1: SER4086CT-ND; Manufacturer 2: AVX Corporation; Manufacturer P/N 2: ST3215SB32768C0HPWBB; Supplier 2: Digi-Key; Supplier Part Number 2: 1253-1113-1-ND; Arena Link: https://app.bom.com/a/L3MU07Q7Q98O5PC8?v=spec.summary; CL: 7pF; Frequency: 32.768kHz; Frequency Tolerance: 20ppm; Height: 0.9mm; Pins: 2